# EAGLE design regelschaltplan_e7 (EAGLE 6.5.0)

## Sheet 1 of 5
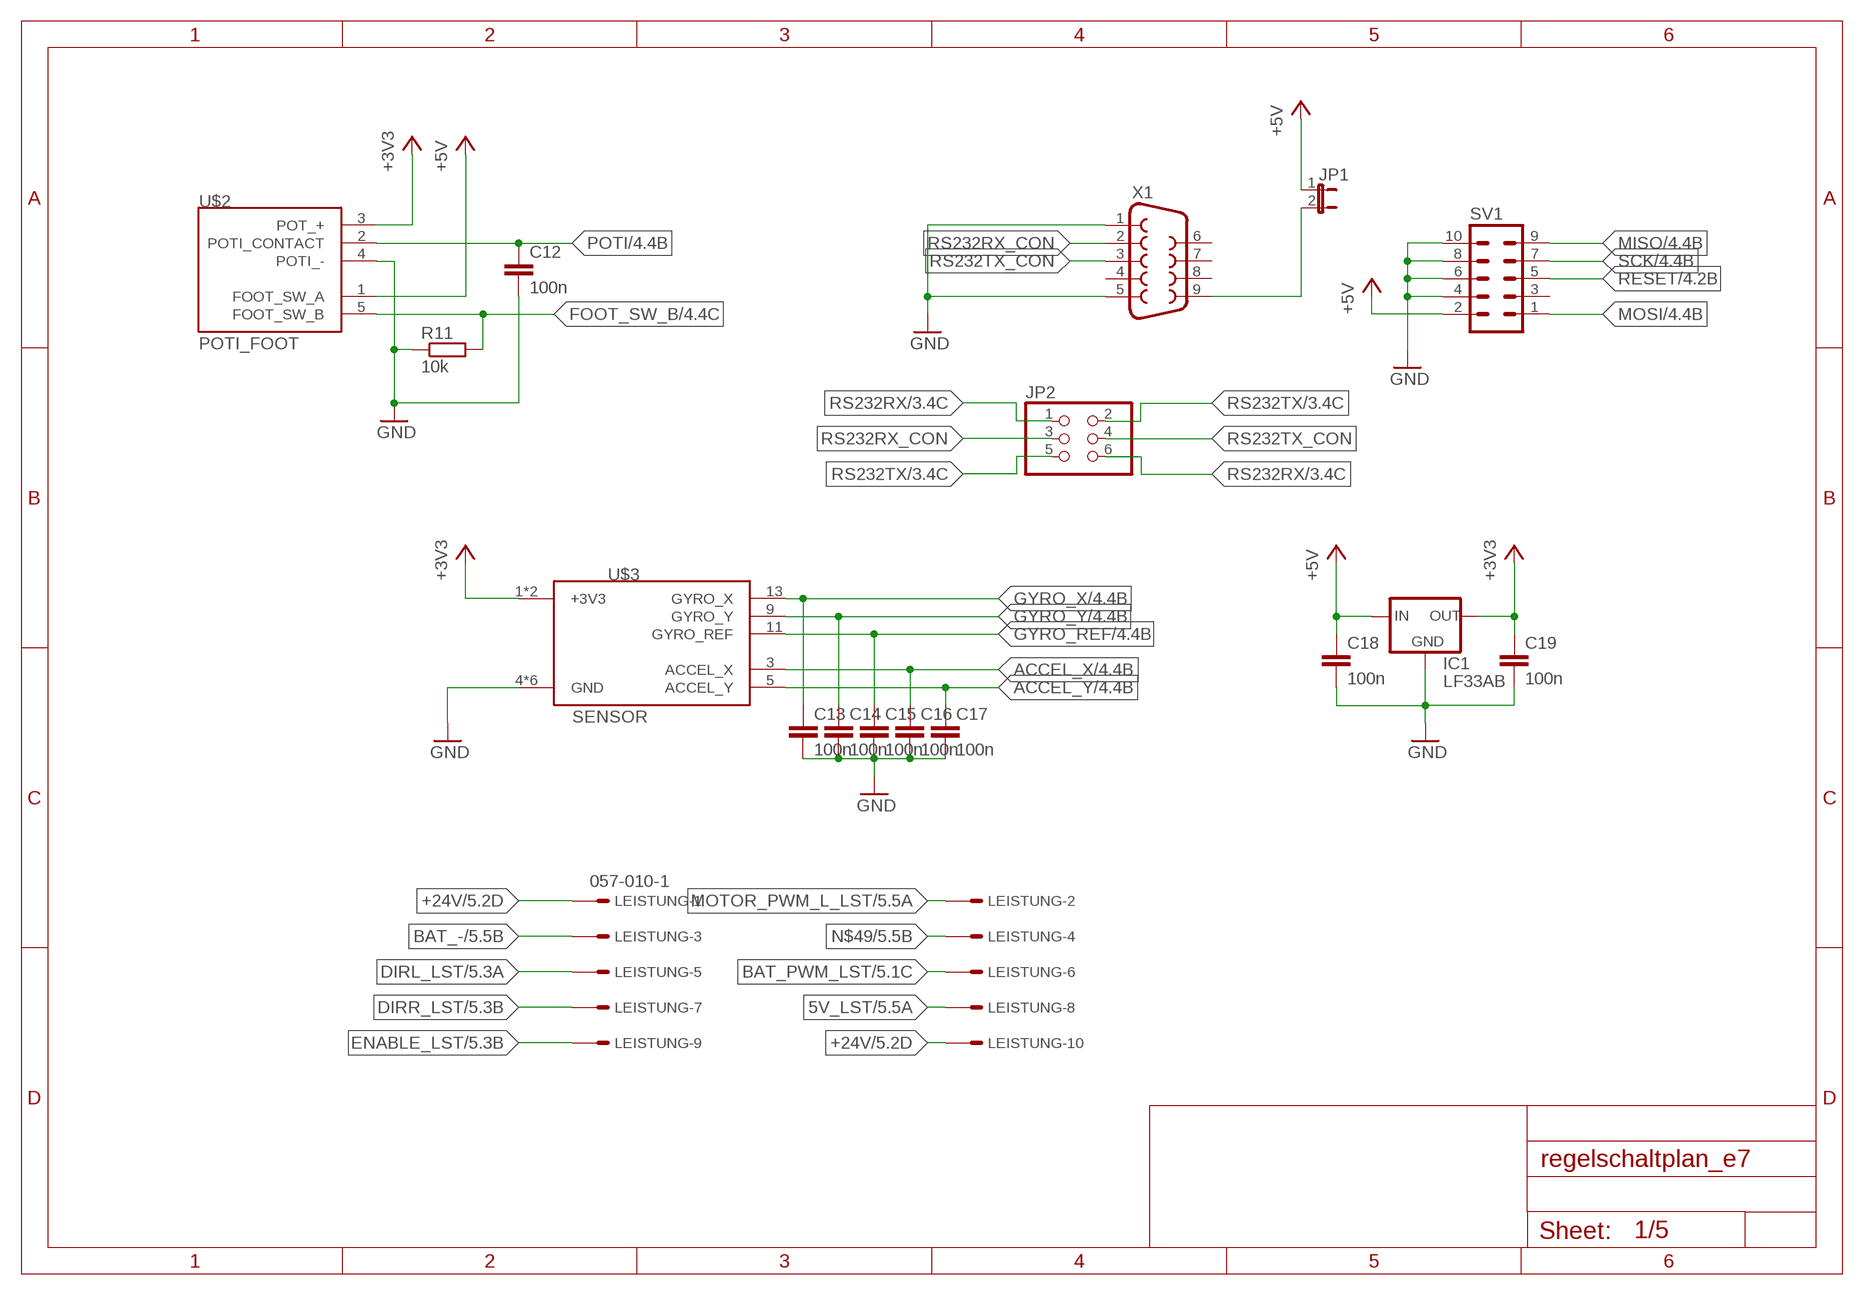
[diagram p0: schematic, sheet 1]

### Parts
C12  100n  C-EU025-025X050  [C025-025X050]
C13  100n  C-EU025-025X050  [C025-025X050]
C14  100n  C-EU025-025X050  [C025-025X050]
C15  100n  C-EU025-025X050  [C025-025X050]
C16  100n  C-EU025-025X050  [C025-025X050]
C17  100n  C-EU025-025X050  [C025-025X050]
C18  100n  C-EU025-025X050  [C025-025X050]
C19  100n  C-EU025-025X050  [C025-025X050]
IC1  LF33AB  [TO220]
JP1  JP1E  [JP1]
JP2  PINHD-2X3  [2X03]
LEISTUNG  057-010-1  [057-010-1]
R11  10k  R-EU_0207/7  [0207/7]
SV1  MA05-2  [MA05-2]
U$2  POTI_FOOT  [CON_6]
U$3  SENSOR  [CON_14]
X1  F09HP  [F09HP]

### Nets
5V_LST: LEISTUNG.8 ; also sheet 5
+3V3: C19.1 IC1.3(OUT) U$2.3(POT_+) U$3.1(+3V3) U$3.2(+3V3) ; also sheet 2,4
+24V: LEISTUNG.1 LEISTUNG.10 ; also sheet 5
ACCEL_X: C16.1 U$3.3(ACCEL_X) ; also sheet 4
ACCEL_Y: C17.1 U$3.5(ACCEL_Y) ; also sheet 4
BAT_-: LEISTUNG.3 ; also sheet 5
BAT_PWM_LST: LEISTUNG.6 ; also sheet 5
DIRL_LST: LEISTUNG.5 ; also sheet 5
DIRR_LST: LEISTUNG.7 ; also sheet 5
ENABLE_LST: LEISTUNG.9 ; also sheet 5
FOOT_SW_B: R11.2 U$2.5(FOOT_SW_B) ; also sheet 4
GND: C12.2 C13.2 C14.2 C15.2 C16.2 C17.2 C18.2 C19.2 IC1.2(GND) R11.1 SV1.4 SV1.6 SV1.8 SV1.10 U$2.4(POTI_-) U$3.4(GND) U$3.6(GND) U$3.8(GND) U$3.10(GND) U$3.12(GND) U$3.14(GND) X1.1 X1.5 ; also sheet 2,3,4,5
GYRO_REF: C15.1 U$3.11(GYRO_REF) ; also sheet 4
GYRO_X: C13.1 U$3.13(GYRO_X) ; also sheet 4
GYRO_Y: C14.1 U$3.9(GYRO_Y) ; also sheet 4
MISO: SV1.9 ; also sheet 4
MOSI: SV1.1 ; also sheet 4
MOTOR_PWM_L_LST: LEISTUNG.2 ; also sheet 5
N$35: C18.1 IC1.1(IN) JP1.1 SV1.2 U$2.1(FOOT_SW_A) ; supply symbol labelled +5V ; also sheet 2,3,4,5
N$45: JP1.2 X1.9
N$49: LEISTUNG.4 ; also sheet 5
POTI: C12.1 U$2.2(POTI_CONTACT) ; also sheet 4
RESET: SV1.5 ; also sheet 4
RS232RX: JP2.1 JP2.6 ; also sheet 3
RS232RX_CON: JP2.3 X1.2
RS232TX: JP2.2 JP2.5 ; also sheet 3
RS232TX_CON: JP2.4 X1.3
SCK: SV1.7 ; also sheet 4
Unconnected: SV1.3 X1.4 X1.6 X1.7 X1.8

## Sheet 2 of 5
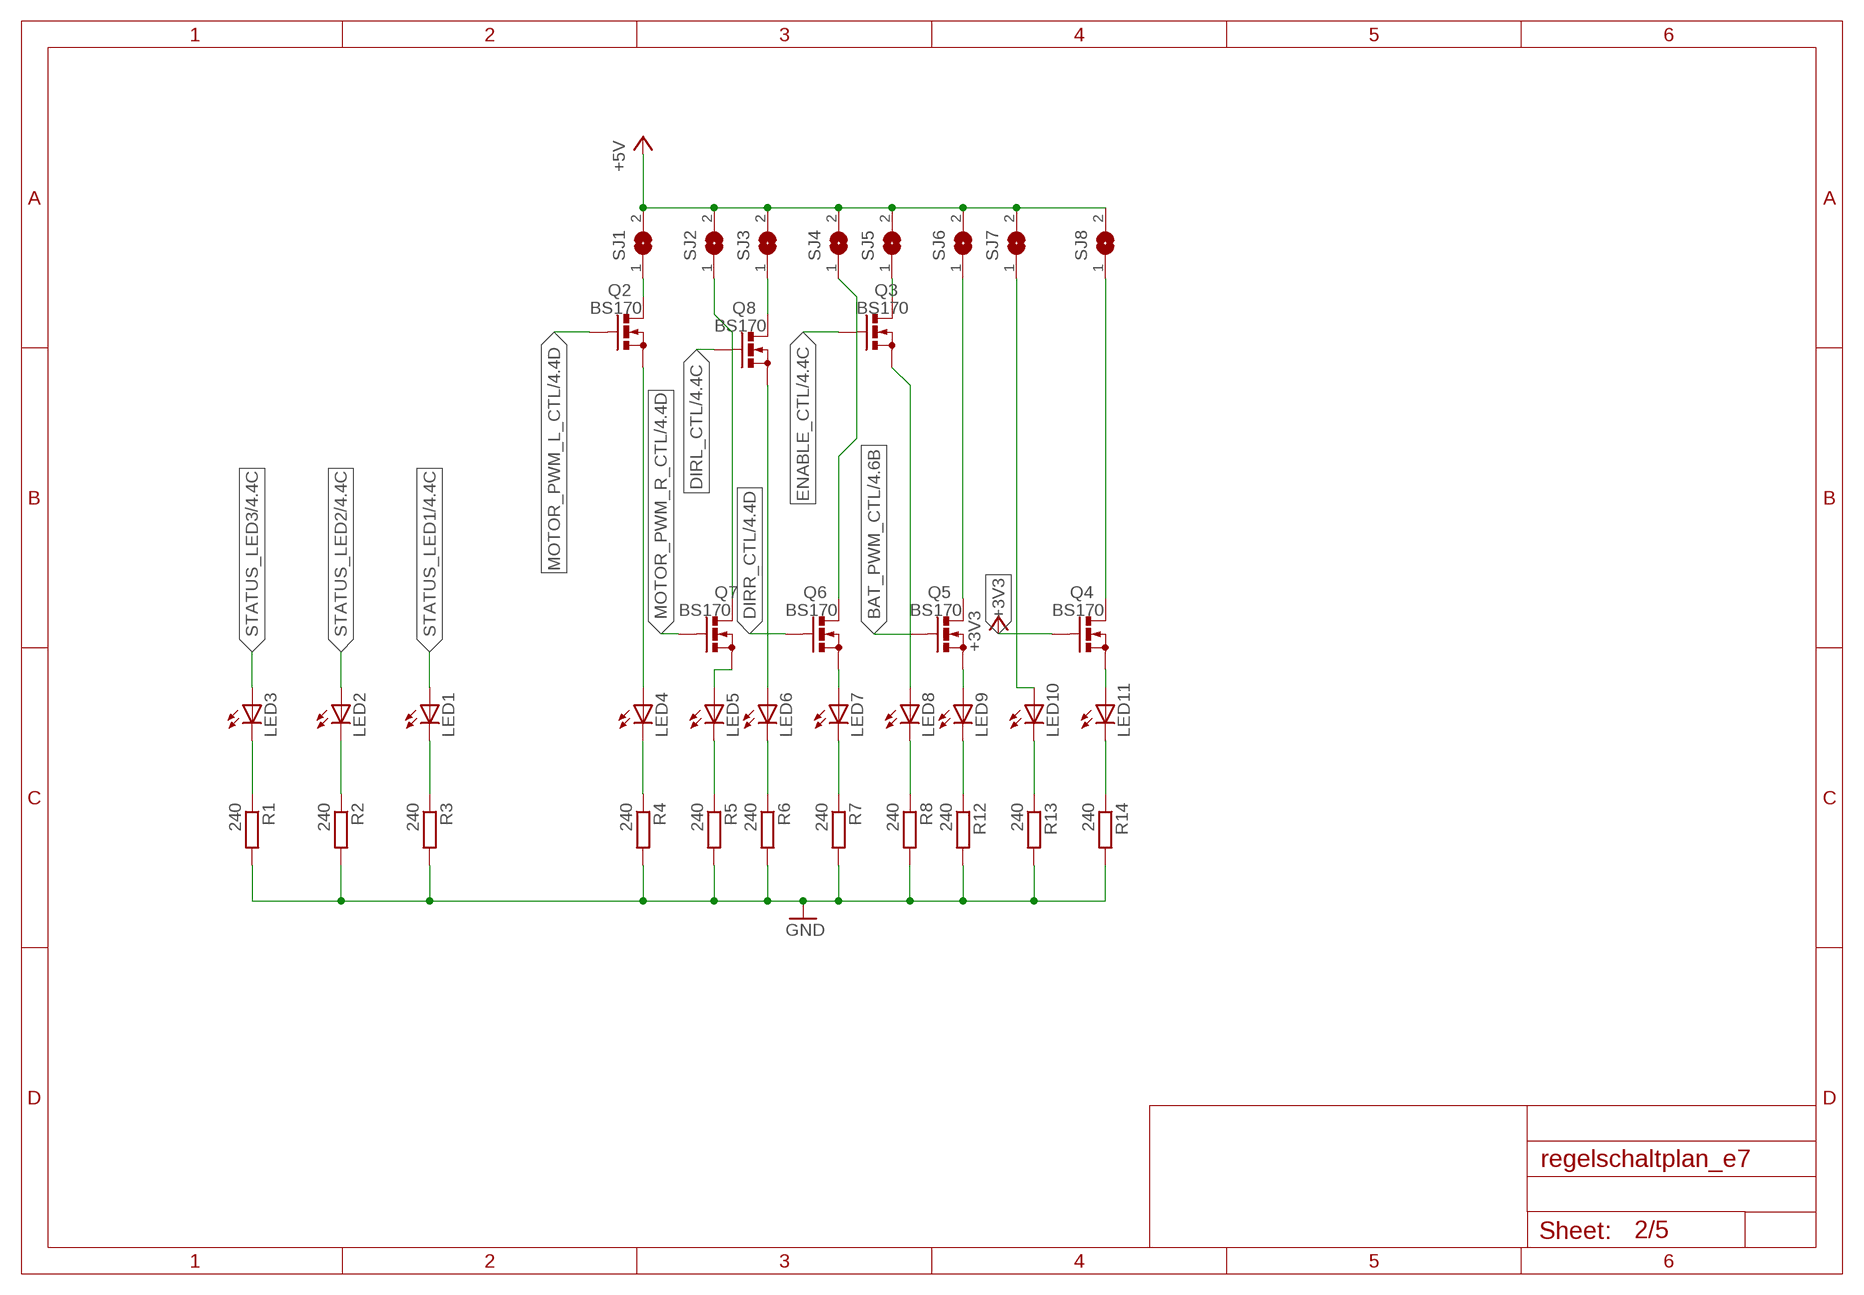
[diagram p1: schematic, sheet 2]

### Parts
LED1  LED3MM  [LED3MM]
LED2  LED3MM  [LED3MM]
LED3  LED3MM  [LED3MM]
LED4  LED3MM  [LED3MM]
LED5  LED3MM  [LED3MM]
LED6  LED3MM  [LED3MM]
LED7  LED3MM  [LED3MM]
LED8  LED3MM  [LED3MM]
LED9  LED3MM  [LED3MM]
LED10  LED3MM  [LED3MM]
LED11  LED3MM  [LED3MM]
Q2  BS170  [SOT54E]
Q3  BS170  [SOT54E]
Q4  BS170  [SOT54E]
Q5  BS170  [SOT54E]
Q6  BS170  [SOT54E]
Q7  BS170  [SOT54E]
Q8  BS170  [SOT54E]
R1  240  R-EU_0207/7  [0207/7]
R2  240  R-EU_0207/7  [0207/7]
R3  240  R-EU_0207/7  [0207/7]
R4  240  R-EU_0207/7  [0207/7]
R5  240  R-EU_0207/7  [0207/7]
R6  240  R-EU_0207/7  [0207/7]
R7  240  R-EU_0207/7  [0207/7]
R8  240  R-EU_0207/7  [0207/7]
R12  240  R-EU_0207/7  [0207/7]
R13  240  R-EU_0207/7  [0207/7]
R14  240  R-EU_0207/7  [0207/7]
SJ1  SJ  [SJ]
SJ2  SJ  [SJ]
SJ3  SJ  [SJ]
SJ4  SJ  [SJ]
SJ5  SJ  [SJ]
SJ6  SJ  [SJ]
SJ7  SJ  [SJ]
SJ8  SJ  [SJ]

### Nets
+3V3: Q4.G ; also sheet 1,4
BAT_PWM_CTL: Q5.G ; also sheet 4,5
DIRL_CTL: Q8.G ; also sheet 4,5
DIRR_CTL: Q6.G ; also sheet 4,5
ENABLE_CTL: Q3.G ; also sheet 4,5
GND: R1.2 R2.2 R3.2 R4.2 R5.2 R6.2 R7.2 R8.2 R12.2 R13.2 R14.2 ; also sheet 1,3,4,5
MOTOR_PWM_L_CTL: Q2.G ; also sheet 4,5
MOTOR_PWM_R_CTL: Q7.G ; also sheet 4,5
N$4: Q2.D SJ1.1
N$7: LED4.K(C) R4.1
N$10: LED5.K(C) R5.1
N$11: LED6.K(C) R6.1
N$13: LED6.A Q8.S
N$14: LED7.K(C) R7.1
N$15: LED8.K(C) R8.1
N$16: LED9.K(C) R12.1
N$17: LED10.K(C) R13.1
N$18: LED11.K(C) R14.1
N$19: LED8.A Q3.S
N$20: LED10.A SJ7.1
N$21: LED9.A Q5.S
N$22: Q4.D SJ8.1
N$23: LED7.A Q6.S
N$24: LED5.A Q7.S
N$25: Q7.D SJ2.1
N$26: LED4.A Q2.S
N$27: LED11.A Q4.S
N$28: LED2.K(C) R2.1
N$29: LED3.K(C) R1.1
N$30: Q6.D SJ4.1
N$31: Q5.D SJ6.1
N$32: Q3.D SJ5.1
N$34: Q8.D SJ3.1
N$35: SJ1.2 SJ2.2 SJ3.2 SJ4.2 SJ5.2 SJ6.2 SJ7.2 SJ8.2 ; supply symbol labelled +5V ; also sheet 1,3,4,5
N$46: LED1.K(C) R3.1
STATUS_LED1: LED1.A ; also sheet 4
STATUS_LED2: LED2.A ; also sheet 4
STATUS_LED3: LED3.A ; also sheet 4

## Sheet 3 of 5
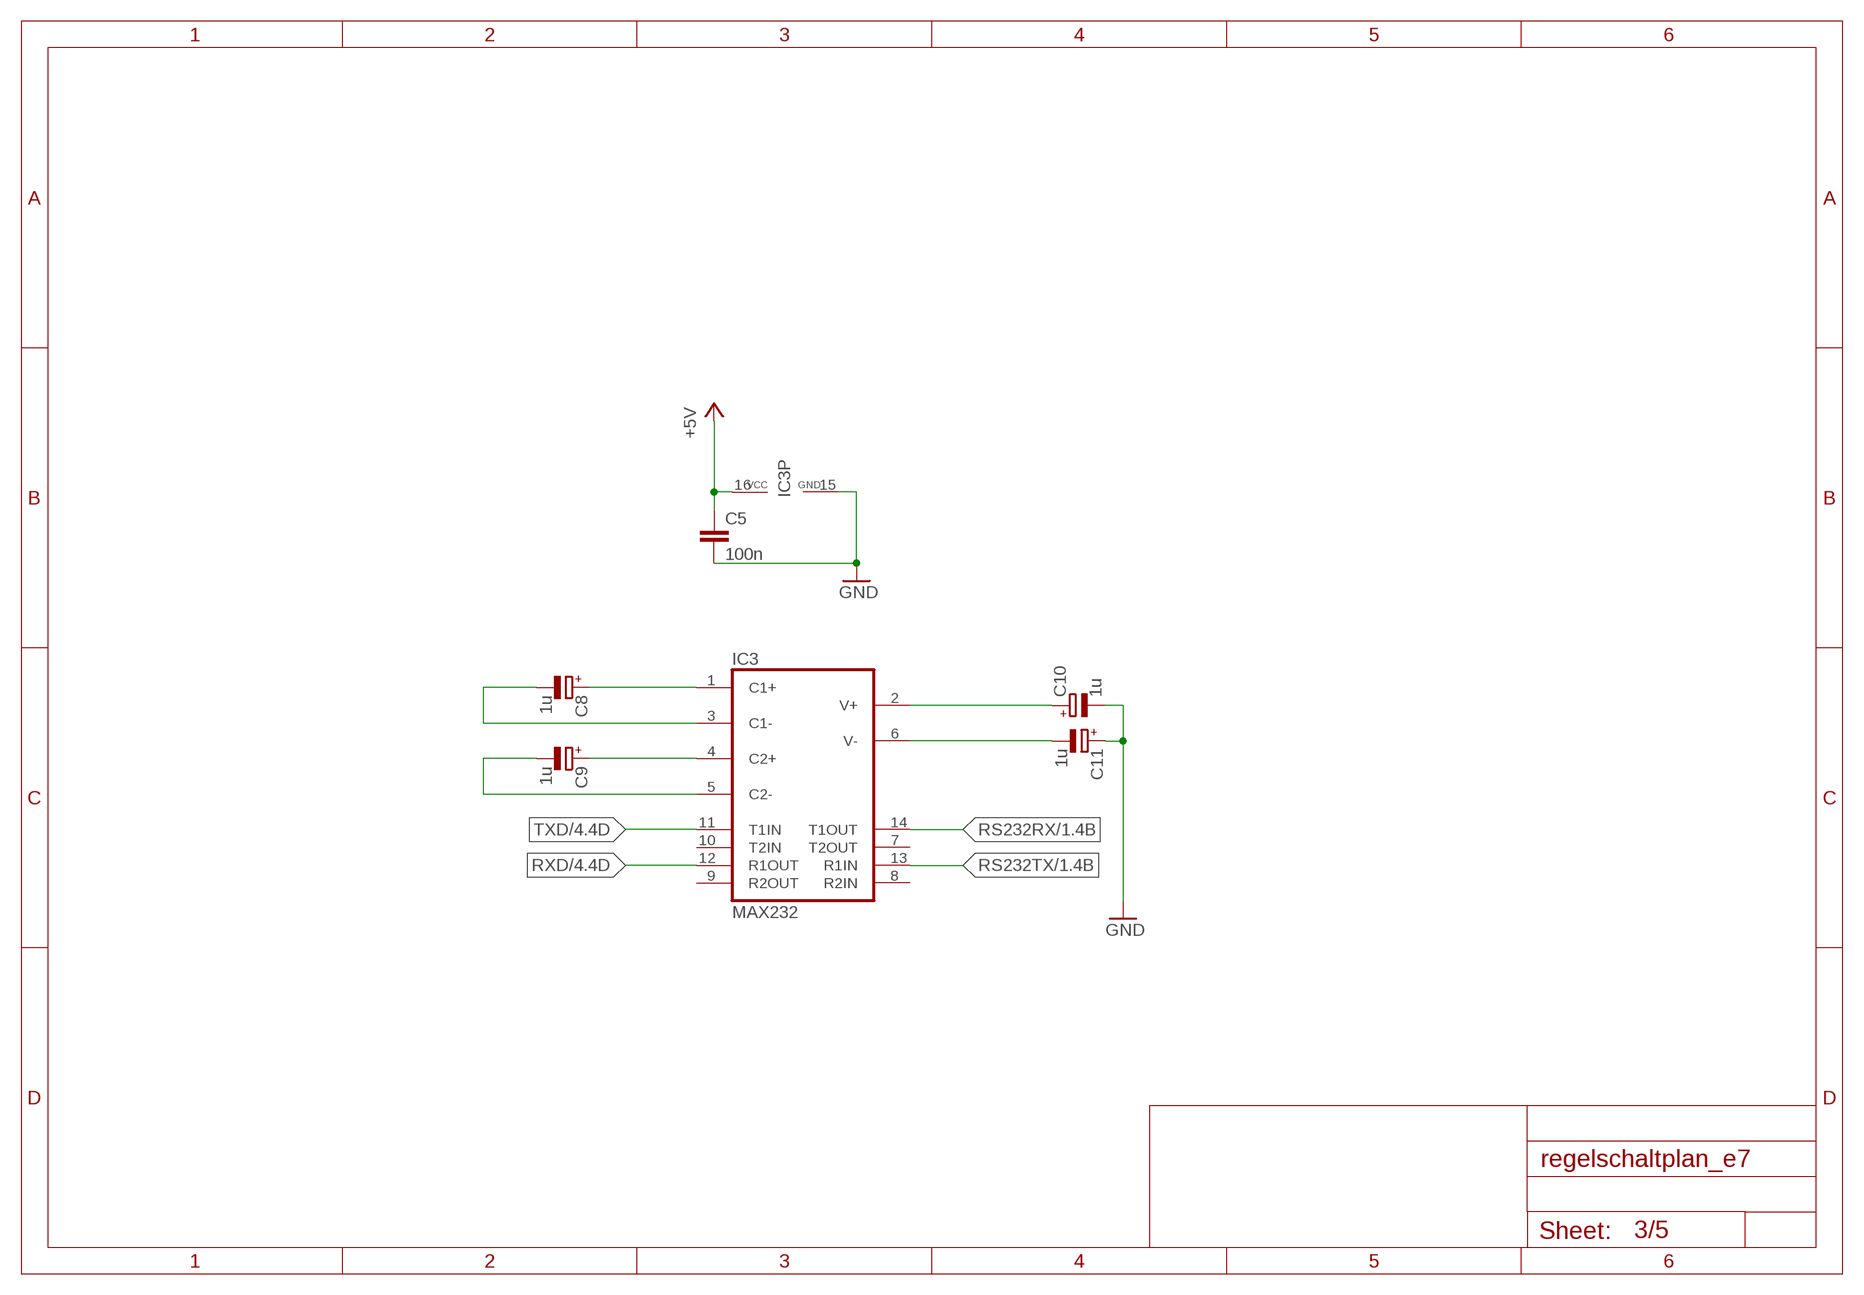
[diagram p2: schematic, sheet 3]

### Parts
C5  100n  C-EU025-025X050  [C025-025X050]
C8  1u  CPOL-EUE2,5-6E  [E2,5-6E]
C9  1u  CPOL-EUE2,5-6E  [E2,5-6E]
C10  1u  CPOL-EUE2,5-6E  [E2,5-6E]
C11  1u  CPOL-EUE2,5-6E  [E2,5-6E]
IC3  MAX232  [DIL16]

### Nets
GND: C5.2 C10.- C11.+ IC3.15(GND) ; also sheet 1,2,4,5
N$1: C8.+ IC3.1(C1+)
N$5: C8.- IC3.3(C1-)
N$6: C9.+ IC3.4(C2+)
N$8: C10.+ IC3.2(V+)
N$9: C11.- IC3.6(V-)
N$35: C5.1 IC3.16(VCC) ; supply symbol labelled +5V ; also sheet 1,2,4,5
NS1234: C9.- IC3.5(C2-)
RS232RX: IC3.14(T1OUT) ; also sheet 1
RS232TX: IC3.13(R1IN) ; also sheet 1
RXD: IC3.12(R1OUT) ; also sheet 4
TXD: IC3.11(T1IN) ; also sheet 4
Unconnected: IC3.7(T2OUT) IC3.8(R2IN) IC3.9(R2OUT) IC3.10(T2IN)

## Sheet 4 of 5
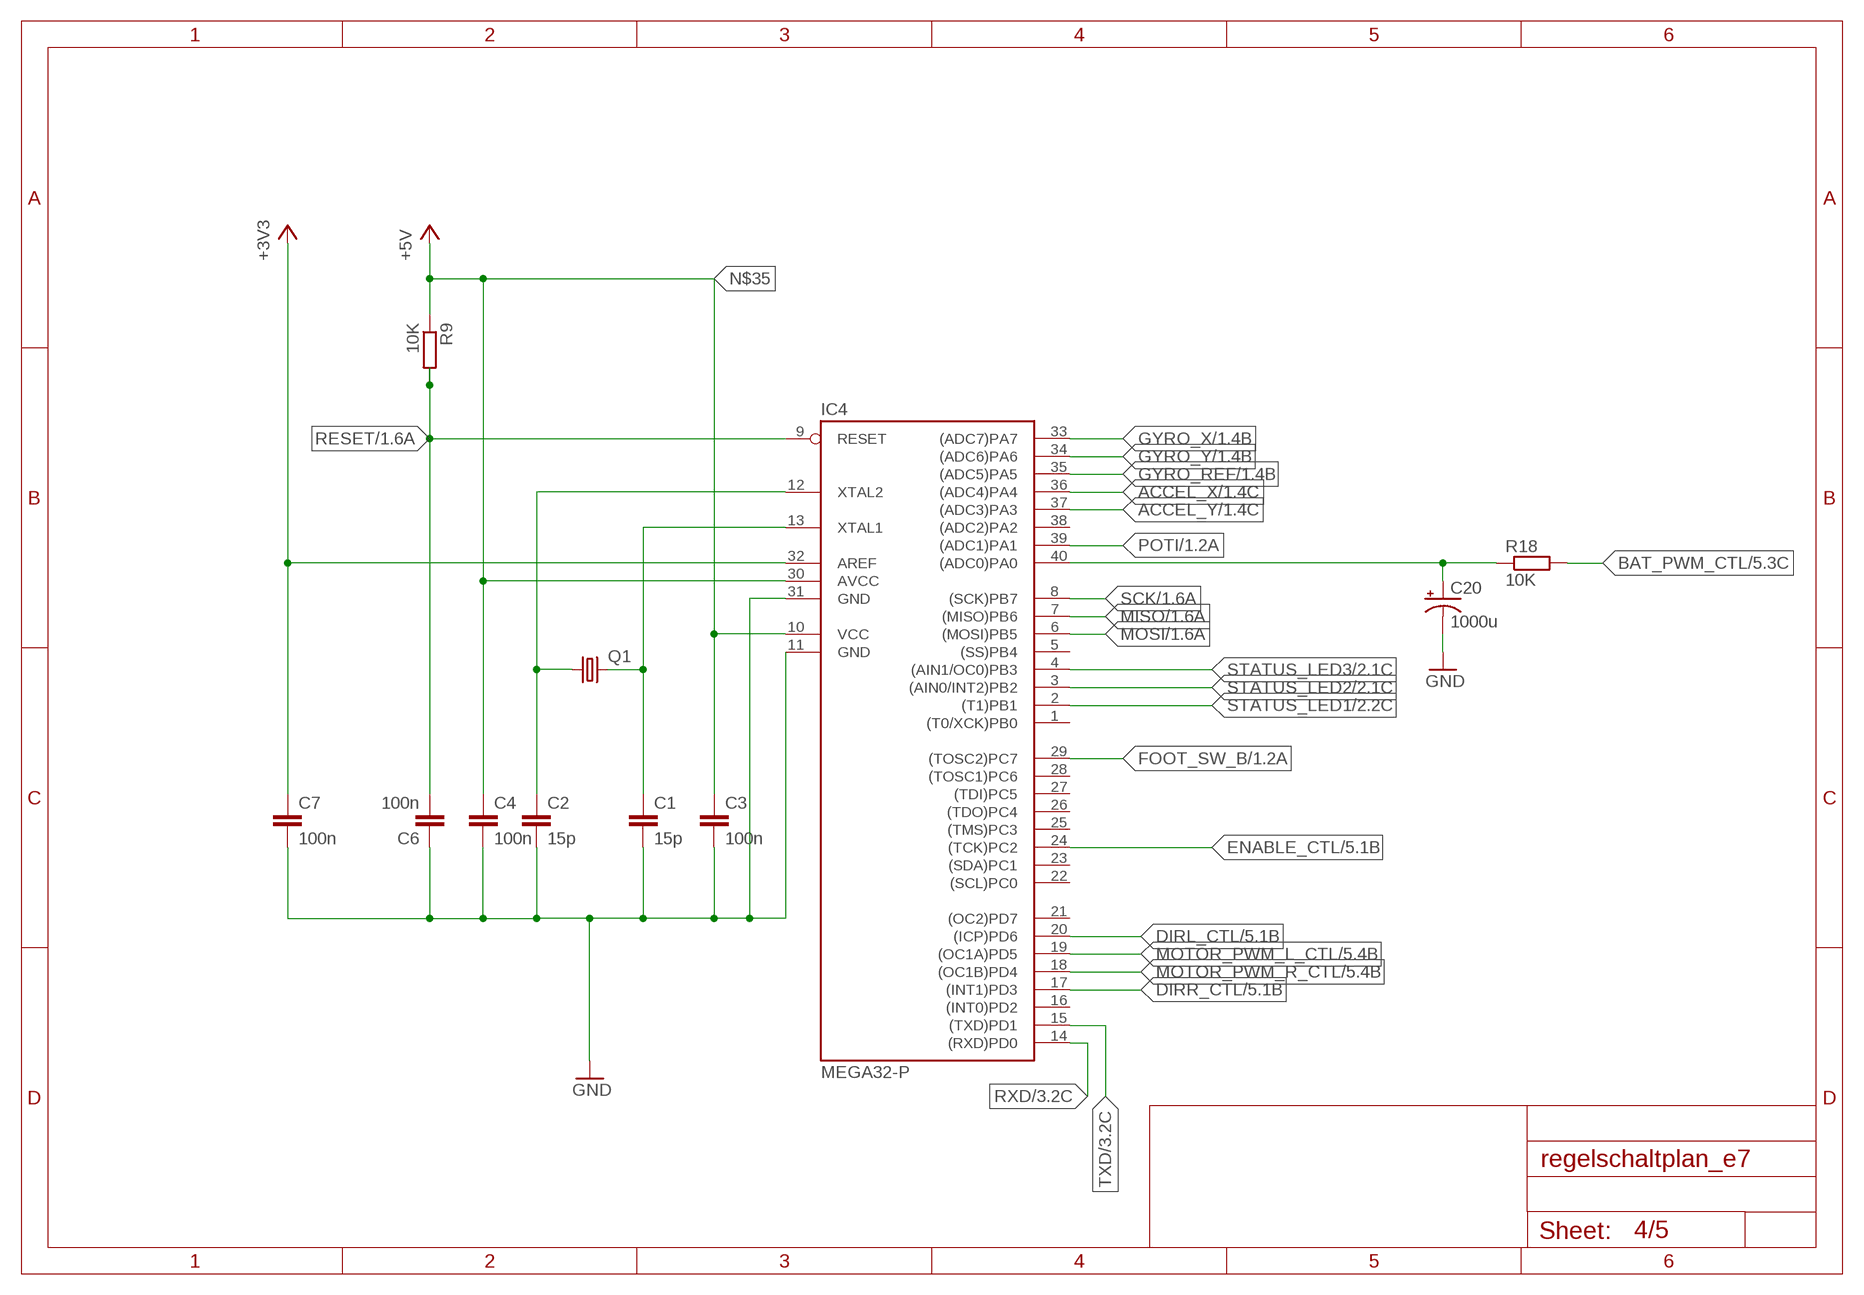
[diagram p3: schematic, sheet 4]

### Parts
C1  15p  C-EU025-025X050  [C025-025X050]
C2  15p  C-EU025-025X050  [C025-025X050]
C3  100n  C-EU025-025X050  [C025-025X050]
C4  100n  C-EU025-025X050  [C025-025X050]
C6  100n  C-EU025-025X050  [C025-025X050]
C7  100n  C-EU025-025X050  [C025-025X050]
C20  1000u  CPOL-USE2,5-6E  [E2,5-6E]
IC4  MEGA32-P  [DIL40]
Q1  CRYSTALHC49U-V  [HC49U-V]
R9  10K  R-EU_0207/7  [0207/7]
R18  10K  R-EU_0207/7  [0207/7]

### Nets
+3V3: C7.1 IC4.32(AREF) ; also sheet 1,2
ACCEL_X: IC4.36((ADC4)PA4) ; also sheet 1
ACCEL_Y: IC4.37((ADC3)PA3) ; also sheet 1
BAT_PWM_CTL: R18.2 ; also sheet 2,5
DIRL_CTL: IC4.20((ICP)PD6) ; also sheet 2,5
DIRR_CTL: IC4.17((INT1)PD3) ; also sheet 2,5
ENABLE_CTL: IC4.24((TCK)PC2) ; also sheet 2,5
FOOT_SW_B: IC4.29((TOSC2)PC7) ; also sheet 1
GND: C1.2 C2.2 C3.2 C4.2 C6.1 C7.2 C20.- IC4.11(GND) IC4.31(GND) ; also sheet 1,2,3,5
GYRO_REF: IC4.35((ADC5)PA5) ; also sheet 1
GYRO_X: IC4.33((ADC7)PA7) ; also sheet 1
GYRO_Y: IC4.34((ADC6)PA6) ; also sheet 1
MISO: IC4.7((MISO)PB6) ; also sheet 1
MOSI: IC4.6((MOSI)PB5) ; also sheet 1
MOTOR_PWM_L_CTL: IC4.19((OC1A)PD5) ; also sheet 2,5
MOTOR_PWM_R_CTL: IC4.18((OC1B)PD4) ; also sheet 2,5
N$2: C2.1 IC4.12(XTAL2) Q1.1
N$3: C1.1 IC4.13(XTAL1) Q1.2
N$12: C20.+ IC4.40((ADC0)PA0) R18.1
N$35: C3.1 C4.1 IC4.10(VCC) IC4.30(AVCC) R9.1 ; supply symbol labelled +5V ; also sheet 1,2,3,5
POTI: IC4.39((ADC1)PA1) ; also sheet 1
RESET: C6.2 IC4.9(RESET) R9.2 ; also sheet 1
RXD: IC4.14((RXD)PD0) ; also sheet 3
SCK: IC4.8((SCK)PB7) ; also sheet 1
STATUS_LED1: IC4.2((T1)PB1) ; also sheet 2
STATUS_LED2: IC4.3((AIN0/INT2)PB2) ; also sheet 2
STATUS_LED3: IC4.4((AIN1/OC0)PB3) ; also sheet 2
TXD: IC4.15((TXD)PD1) ; also sheet 3
Unconnected: IC4.1((T0/XCK)PB0) IC4.5((SS)PB4) IC4.16((INT0)PD2) IC4.21((OC2)PD7) IC4.22((SCL)PC0) IC4.23((SDA)PC1) IC4.25((TMS)PC3) IC4.26((TDO)PC4) IC4.27((TDI)PC5) IC4.28((TOSC1)PC6) IC4.38((ADC2)PA2)

## Sheet 5 of 5: galvanic decoupling
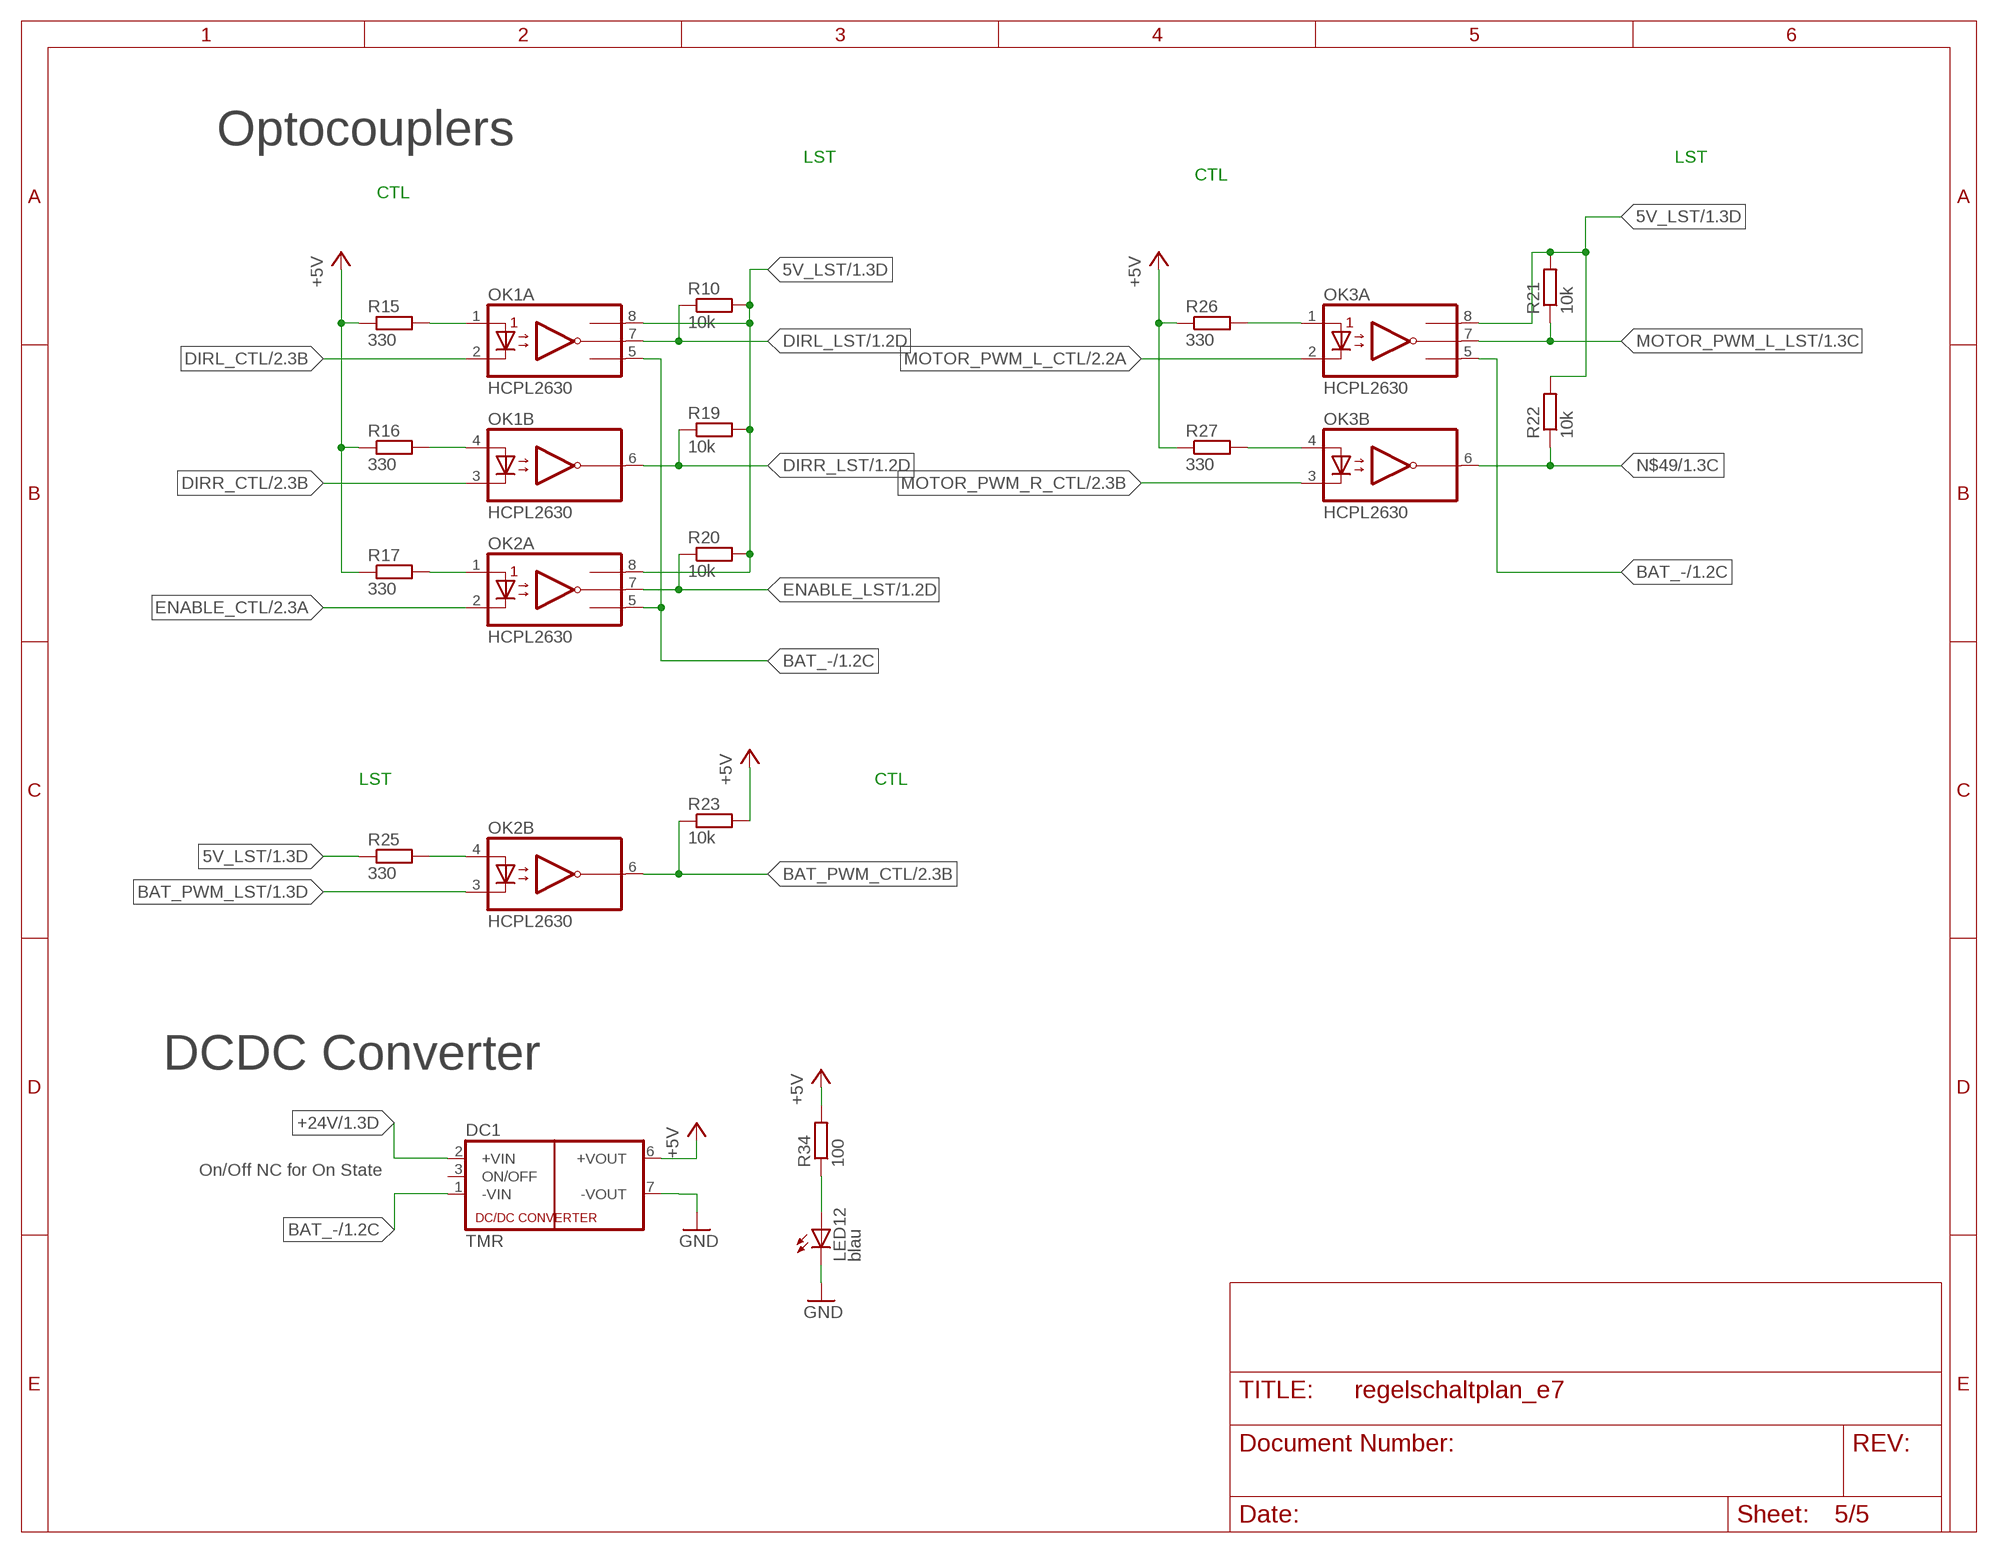
[diagram p4: schematic, sheet 5]

### Parts
DC1  TMR  [TRACO_SIP-8]
LED12  blau  LED3MM  [LED3MM]
OK1  HCPL2630  [DIL08]
OK2  HCPL2630  [DIL08]
OK3  HCPL2630  [DIL08]
R10  10k  R-EU_0207/10  [0207/10]
R15  330  R-EU_0207/10  [0207/10]
R16  330  R-EU_0207/10  [0207/10]
R17  330  R-EU_0207/10  [0207/10]
R19  10k  R-EU_0207/10  [0207/10]
R20  10k  R-EU_0207/10  [0207/10]
R21  10k  R-EU_0207/10  [0207/10]
R22  10k  R-EU_0207/10  [0207/10]
R23  10k  R-EU_0207/10  [0207/10]
R25  330  R-EU_0207/10  [0207/10]
R26  330  R-EU_0207/10  [0207/10]
R27  330  R-EU_0207/10  [0207/10]
R34  100  R-EU_0207/10  [0207/10]

### Nets
5V_LST: OK1.8(A:VCC) OK2.8(A:VCC) OK3.8(A:VCC) R10.2 R19.2 R20.2 R21.2 R22.2 R25.1 ; also sheet 1
+24V: DC1.2(+VIN) ; also sheet 1
BAT_-: DC1.1(-VIN) OK1.5(A:GND) OK2.5(A:GND) OK3.5(A:GND) ; also sheet 1
BAT_PWM_CTL: OK2.6(B:VO2) R23.1 ; also sheet 2,4
BAT_PWM_LST: OK2.3(B:C2) ; also sheet 1
DIRL_CTL: OK1.2(A:C1) ; also sheet 2,4
DIRL_LST: OK1.7(A:VO1) R10.1 ; also sheet 1
DIRR_CTL: OK1.3(B:C2) ; also sheet 2,4
DIRR_LST: OK1.6(B:VO2) R19.1 ; also sheet 1
ENABLE_CTL: OK2.2(A:C1) ; also sheet 2,4
ENABLE_LST: OK2.7(A:VO1) R20.1 ; also sheet 1
GND: DC1.7(-VOUT) LED12.K(C) ; also sheet 1,2,3,4
MOTOR_PWM_L_CTL: OK3.2(A:C1) ; also sheet 2,4
MOTOR_PWM_L_LST: OK3.7(A:VO1) R21.1 ; also sheet 1
MOTOR_PWM_R_CTL: OK3.3(B:C2) ; also sheet 2,4
N$35: DC1.6(+VOUT) R15.1 R16.1 R17.1 R23.2 R26.1 R27.1 R34.2 ; supply symbol labelled +5V ; also sheet 1,2,3,4
N$36: OK1.1(A:A1) R15.2
N$37: OK1.4(B:A2) R16.2
N$38: OK2.1(A:A1) R17.2
N$39: OK2.4(B:A2) R25.2
N$40: OK3.4(B:A2) R27.2
N$41: OK3.1(A:A1) R26.2
N$42: LED12.A R34.1
N$49: OK3.6(B:VO2) R22.1 ; also sheet 1
Unconnected: DC1.3(ON/OFF)

### Notes on the sheet
- Optocouplers
- LST | LST
- CTL
- CTL
- LST | CTL
- DCDC Converter
- On/Off NC for On State

## Library data of the parts
C1-C7 C12-C19 = rcl:C-EU: CAPACITOR, European symbol
C8-C11 = rcl:CPOL-EU: POLARIZED CAPACITOR, European symbol
C20 = rcl:CPOL-US: POLARIZED CAPACITOR, American symbol
DC1 = regelschaltplan_e7:TMR
IC1 = lsd2016:LF33AB
IC3 = maxim:MAX232: RS232 TRANSCEIVER; MF: MAXIM; MPN: MAX232ACPE+; OC_FARNELL: 9723773; OC_NEWARK: 68K4544
IC4 = atmel:MEGA32-P: MICROCONTROLLER 32 Kbytes FLASH 2 Kbytes SRAM 1 Kbytes EEPROM USART 8-channel 10 bit ADC Source: www.atmel.com .. doc2503.pdf; MPN: ATMEGA32-16PU; OC_FARNELL: 1661729; OC_NEWARK: 51P1794
JP1 = jumper:JP1E: JUMPER
JP2 = pinhead:PINHD-2X3: PIN HEADER
LED1-LED12 = led:LED: LED OSRAM: - CHIPLED LG R971, LG N971, LY N971, LG Q971, LY Q971, LO R971, LY R971 LH N974, LH R974 LS Q976, LO Q976, LY Q976 LO Q996 - Hyper CHIPLED LW Q18S LB Q993, LB Q99A, LB R99A - SideLED LS A670, LO A670, LY A670, LG A670, LP A670 LB A673, LV A673, LT A673, LW A673 LH A674 LY A675 LS A676, LA A676, LO A676, LY A676, LW A676 LS A679, LY A679, LG A679 - Hyper Micro SIDELED® LS Y876, LA Y876, LO Y876, LY Y876 LT Y87S - SmartLED LW L88C, LW L88S LB L89C, LB L89S, LG L890 LS L89K, LO L89K, LY L89K LS L896, LA L896, LO L896, LY L896 - TOPLED LS T670, LO T670, LY T670, LG T670, LP T670 LSG T670, LSP T670, LSY T670, LOP T670, LYG T670 LG T671, LOG T671, LSG T671 LB T673, LV T673, LT T673, LW T673 LH T674 LS T676, LA T676, LO T676, LY T676, LB T676, LH T676, LSB T676, LW T676 LB T67C, LV T67C, LT T67C, LS T67K, LO T67K, LY T67K, LW E67C LS E67B, LA E67B, LO E67B, LY E67B, LB E67C, LV E67C, LT E67C LW T67C LS T679, LY T679, LG T679 LS T770, LO T770, LY T770, LG T770, LP T770 LB T773, LV T773, LT T773, LW T773 LH T774 LS E675, LA E675, LY E675, LS T675 LS T776, LA T776, LO T776, LY T776, LB T776 LHGB T686 LT T68C, LB T68C - Hyper Mini TOPLED® LB M676 - Mini TOPLED Santana® LG M470 LS M47K, LO M47K, LY M47K Source: http://www.osram.convergy.de LUXEON: - LUMILED® LXK2-PW12-R00, LXK2-PW12-S00, LXK2-PW14-U00, LXK2-PW14-V00 LXK2-PM12-R00, LXK2-PM12-S00, LXK2-PM14-U00 LXK2-PE12-Q00, LXK2-PE12-R00, LXK2-PE12-S00, LXK2-PE14-T00, LXK2-PE14-U00 LXK2-PB12-K00, LXK2-PB12-L00, LXK2-PB12-M00, LXK2-PB14-N00, LXK2-PB14-P00, LXK2-PB14-Q00 LXK2-PR12-L00, LXK2-PR12-M00, LXK2-PR14-Q00, LXK2-PR14-R00 LXK2-PD12-Q00, LXK2-PD12-R00, LXK2-PD12-S00 LXK2-PH12-R00, LXK2-PH12-S00 LXK2-PL12-P00, LXK2-PL12-Q00, LXK2-PL12-R00 Source: www.luxeon.com KINGBRIGHT: KA-3528ASYC Source: www.kingbright.com
LEISTUNG = con-panduit:057-010-: CONNECTOR 10-pin series 057 contact pc board low profile headers; OC_FARNELL: unknown; OC_NEWARK: unknown
OK1-OK3 = optocoupler:HCPL2630: HEWLETT PACKARD OPTO COUPLER; MF: AGILENT TECHNOLOGIES; MPN: HCPL-2630-000E; OC_FARNELL: 9994904; OC_NEWARK: 88H7813
Q1 = crystal:CRYSTAL: CRYSTAL; OC_FARNELL: 1666969; OC_NEWARK: unknown
Q2-Q8 = transistor-small-signal:BS170: N-CHANNEL MOS FET
R1-R23 R25-R27 R34 = rcl:R-EU_: RESISTOR, European symbol
SJ1-SJ8 = jumper:SJ: SMD solder JUMPER
SV1 = con-lstb:MA05-2: PIN HEADER; OC_FARNELL: unknown; OC_NEWARK: unknown
U$2 = lsd2016:POTI_FOOT
U$3 = lsd2016:SENSOR
X1 = con-subd:F09: SUB-D; OC_FARNELL: unknown; OC_NEWARK: unknown

## Board
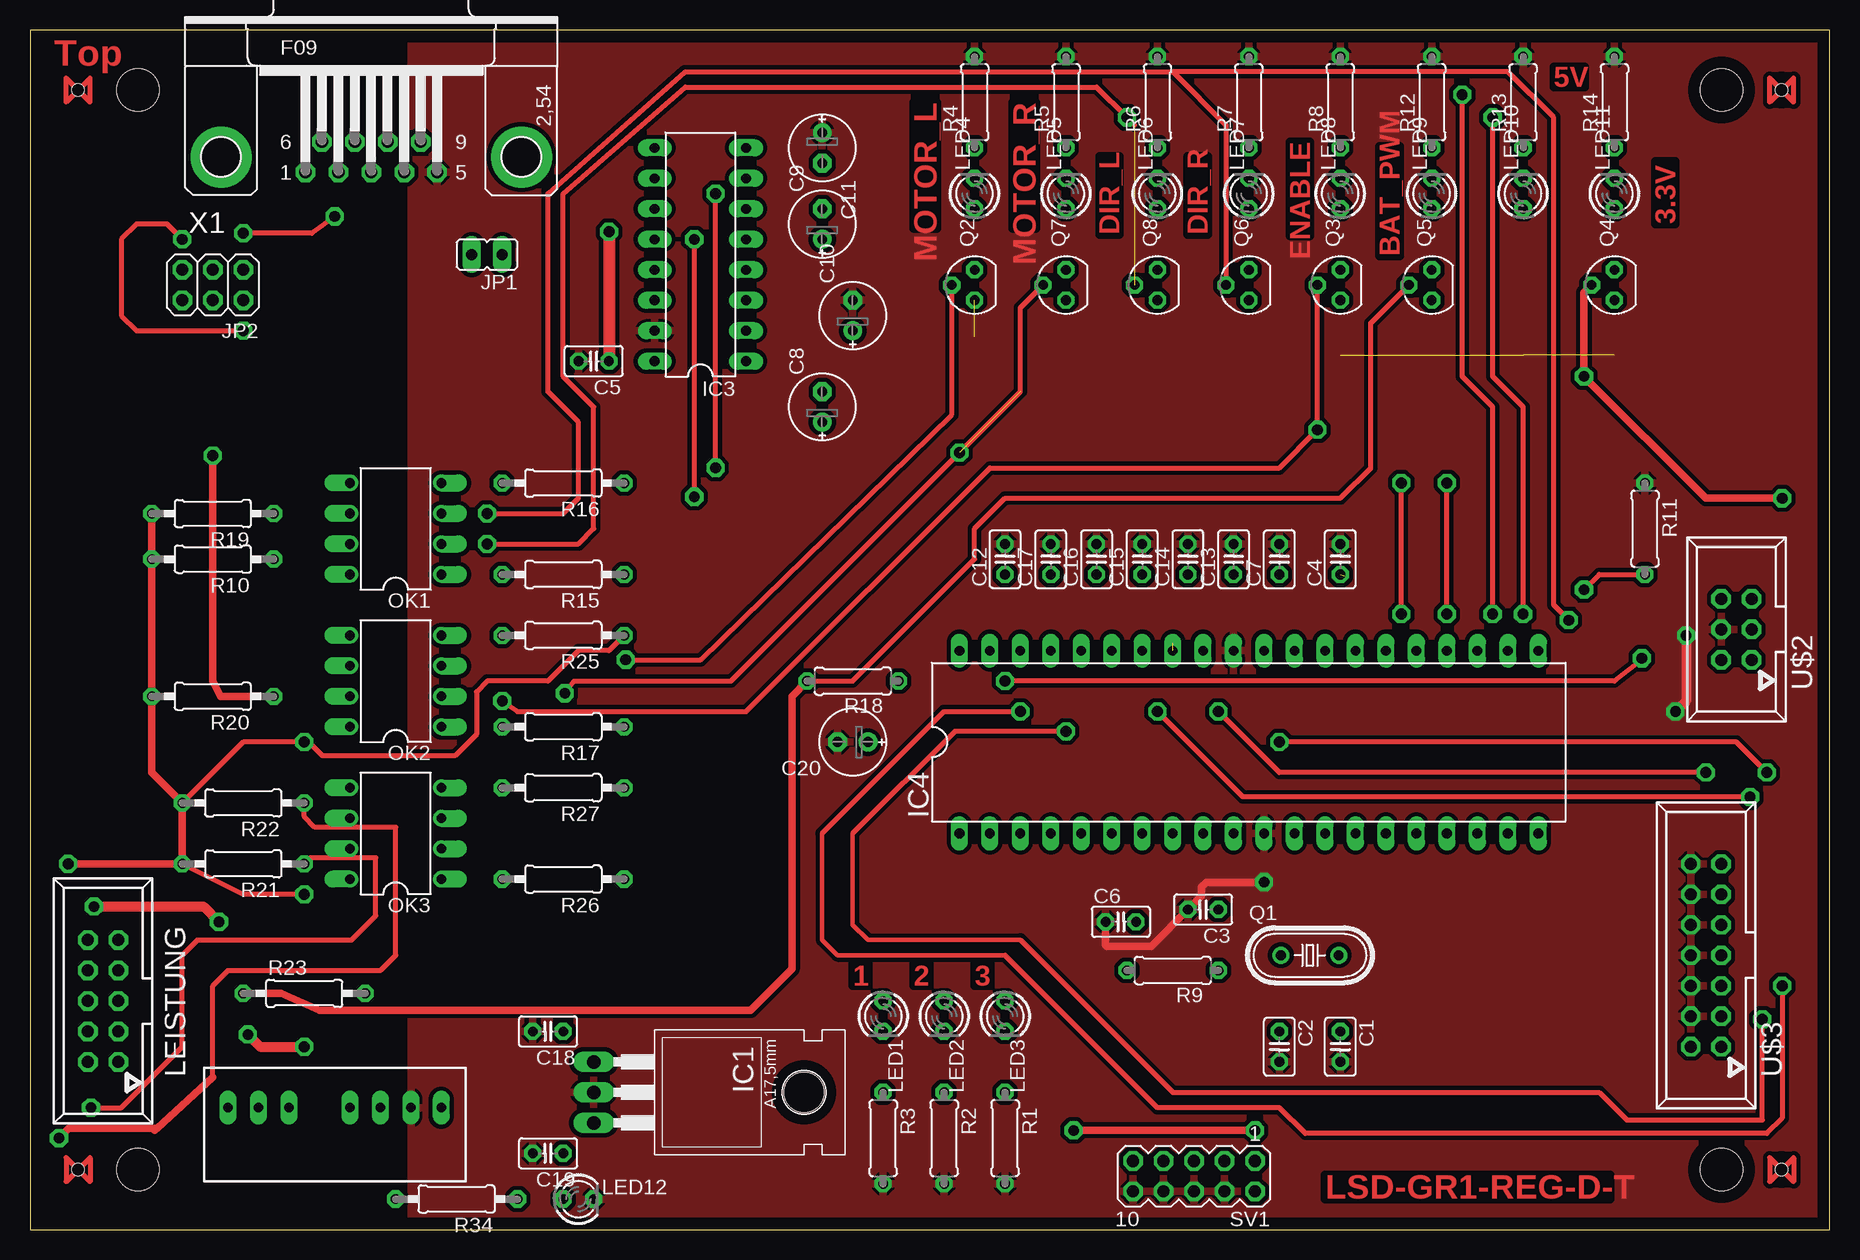
[diagram p5: board, top side]
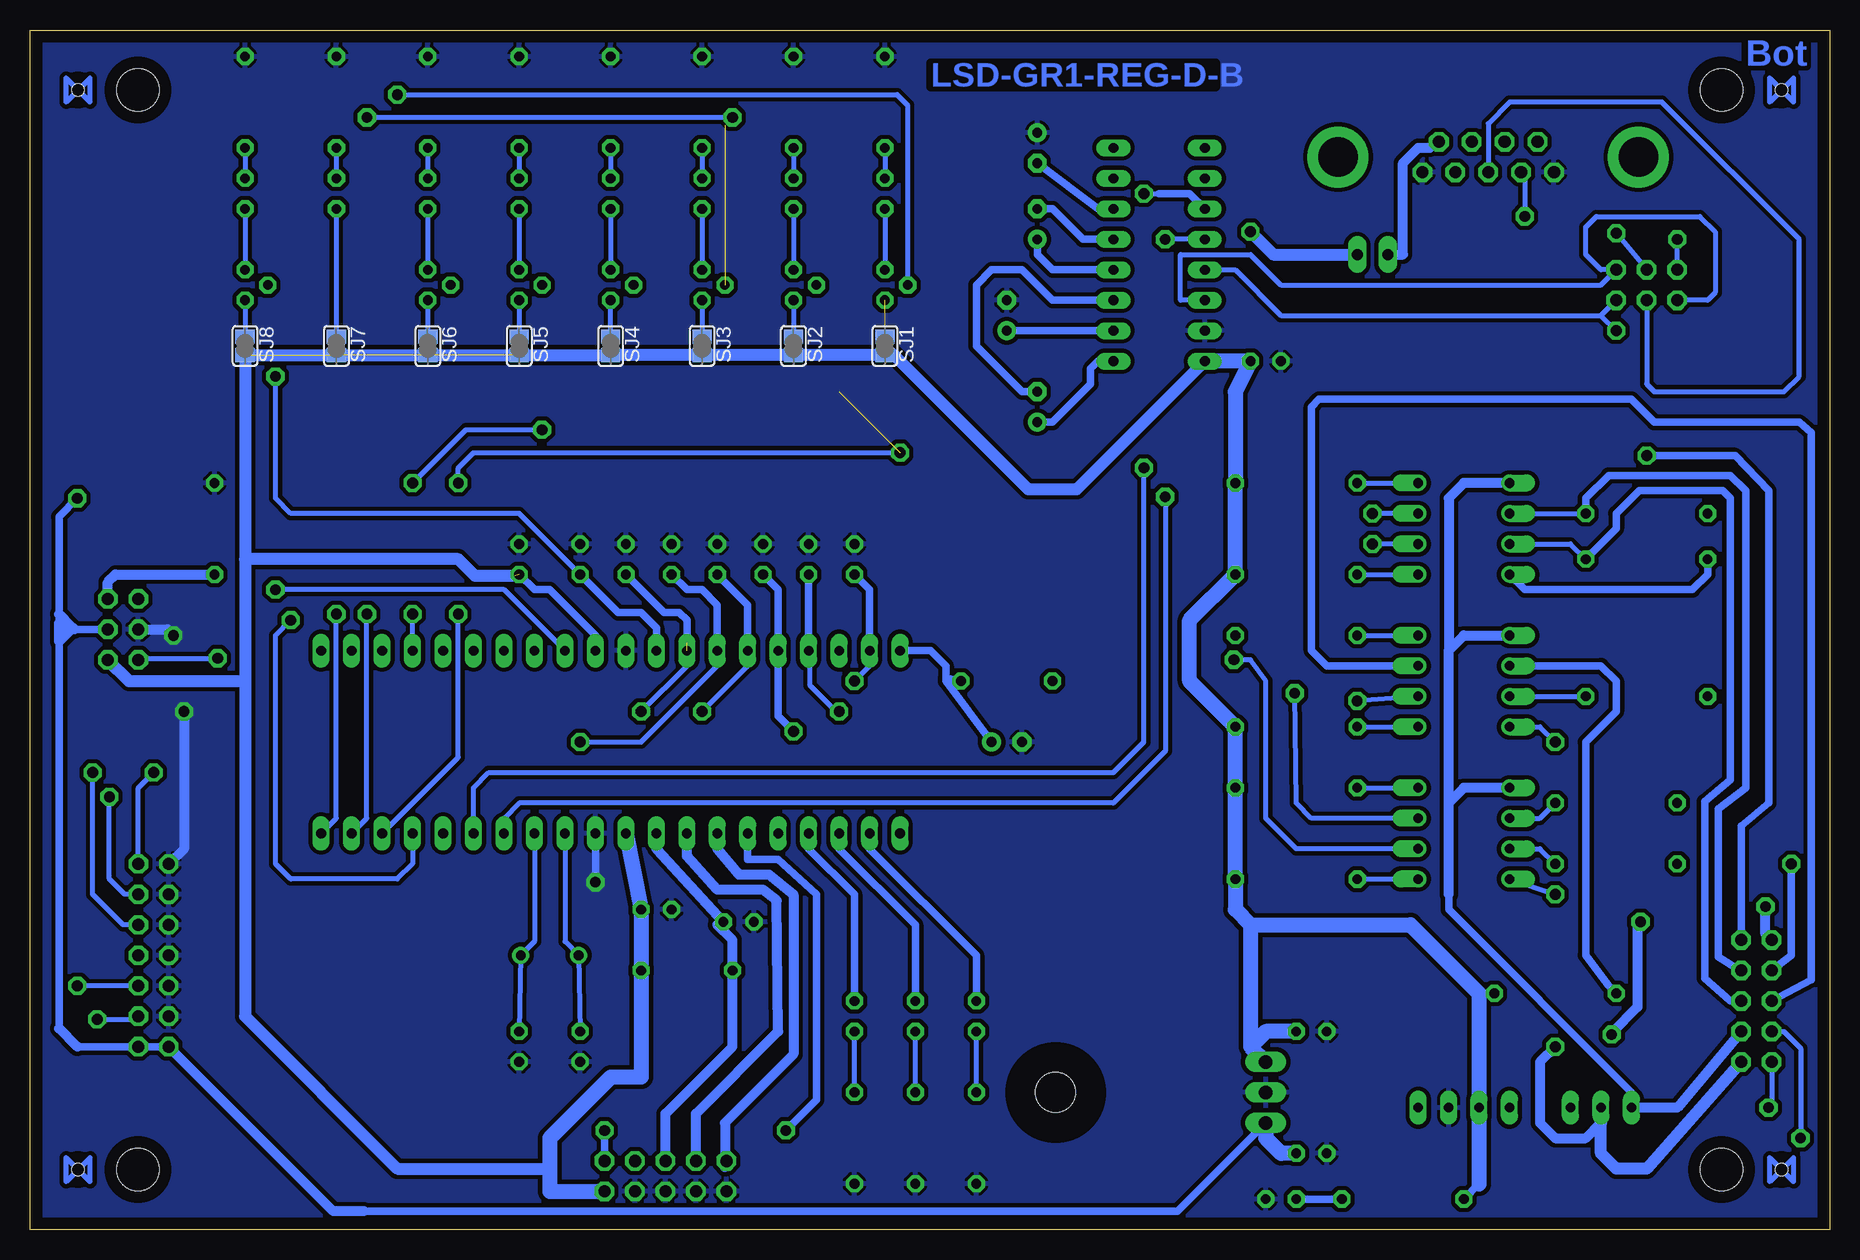
[diagram p6: board, bottom side, seen from below]

Size 150 x 100 mm. Coordinates in mm from the lower left corner, seen from the top.
Copper layers (1*16): Top 0.035mm / dielectric 1.5mm / Bottom 0.035mm
Design rules "default *": minimum track width 14mil, minimum drill 0.8mm, track to track 14mil, track to pad 14mil, pad to pad 14mil, via to via 14mil, smd to smd 14mil, copper to edge 40mil, drill to drill 14mil, minimum pad ring 12mil, minimum via ring 12mil, stop-mask expansion 6mil, vias tented up to drill 0mil, thermal gap 10mil

### Footprints (pad centres in the part's own frame; a part is rotated, then mirrored left to right if it is on the bottom)
C025-025X050 = drill 0.813 octagon: 1 -1.27,0; 2 1.27,0
E2,5-6E = drill 0.813 pad 1.575: + -1.27,0 | drill 0.813 pad 1.575 octagon: - 1.27,0
TRACO_SIP-8 = drill 0.8 long: 1 -8.89,0; 2 -6.35,0; 3 -3.81,0; 5 1.27,0; 6 3.81,0; 7 6.35,0; 8 8.89,0
TO220 = drill 1.118 long: 1 -2.54,-6.35; 2 0,-6.35; 3 2.54,-6.35 | hole 3.302: 0,11.176
DIL16 = drill 0.813 long: 1 -8.89,-3.81; 2 -6.35,-3.81; 3 -3.81,-3.81; 4 -1.27,-3.81; 5 1.27,-3.81; 6 3.81,-3.81; 7 6.35,-3.81; 8 8.89,-3.81; 9 8.89,3.81; 10 6.35,3.81; 11 3.81,3.81; 12 1.27,3.81; 13 -1.27,3.81; 14 -3.81,3.81; 15 -6.35,3.81; 16 -8.89,3.81
DIL40 = drill 0.813 long: 1 -24.13,-7.62; 2 -21.59,-7.62; 3 -19.05,-7.62; 4 -16.51,-7.62; 5 -13.97,-7.62; 6 -11.43,-7.62; 7 -8.89,-7.62; 8 -6.35,-7.62; 9 -3.81,-7.62; 10 -1.27,-7.62; 11 1.27,-7.62; 12 3.81,-7.62; 13 6.35,-7.62; 14 8.89,-7.62; 15 11.43,-7.62; 16 13.97,-7.62; 17 16.51,-7.62; 18 19.05,-7.62; 19 21.59,-7.62; 20 24.13,-7.62; 21 24.13,7.62; 22 21.59,7.62; 23 19.05,7.62; 24 16.51,7.62; 25 13.97,7.62; 26 11.43,7.62; 27 8.89,7.62; 28 6.35,7.62; 29 3.81,7.62; 30 1.27,7.62; 31 -1.27,7.62; 32 -3.81,7.62; 33 -6.35,7.62; 34 -8.89,7.62; 35 -11.43,7.62; 36 -13.97,7.62; 37 -16.51,7.62; 38 -19.05,7.62; 39 -21.59,7.62; 40 -24.13,7.62
JP1 = drill 0.914 long: 1 0,-1.27; 2 0,1.27
2X03 = drill 1.016 octagon: 1 -2.54,-1.27; 2 -2.54,1.27; 3 0,-1.27; 4 0,1.27; 5 2.54,-1.27; 6 2.54,1.27
LED3MM = drill 0.813 octagon: A -1.27,0; K 1.27,0
057-010-1 = drill 1 octagon: 1 -5.08,-1.27; 2 -5.08,1.27; 3 -2.54,-1.27; 4 -2.54,1.27; 5 0,-1.27; 6 0,1.27; 7 2.54,-1.27; 8 2.54,1.27; 9 5.08,-1.27; 10 5.08,1.27
DIL08 = drill 0.813 offset: 1 -3.81,-3.81; 2 -1.27,-3.81; 3 1.27,-3.81; 4 3.81,-3.81; 5 3.81,3.81; 6 1.27,3.81; 7 -1.27,3.81; 8 -3.81,3.81
HC49U-V = drill 0.813: 1 -2.413,0; 2 2.413,0
SOT54E = drill 0.813 octagon: D -1.27,0; G 0,1.905; S 1.27,0
0207/7 = drill 0.813 octagon: 1 -3.81,0; 2 3.81,0
0207/10 = drill 0.813 octagon: 1 -5.08,0; 2 5.08,0
SJ = smd 1.168 x 1.6: 1 -0.762,0; 2 0.762,0
MA05-2 = drill 1.016 octagon: 1 -5.08,-1.27; 2 -5.08,1.27; 3 -2.54,-1.27; 4 -2.54,1.27; 5 0,-1.27; 6 0,1.27; 7 2.54,-1.27; 8 2.54,1.27; 9 5.08,-1.27; 10 5.08,1.27
BOARD = hole 3.5: 9,5; 9,95; 141,95; 141,5 | hole 1: 4,95; 146,5; 4,5; 146,95
CON_6 = drill 1 octagon: 1 -2.54,-1.27; 2 -2.54,1.27; 3 0,-1.27; 4 0,1.27; 5 2.54,-1.27; 6 2.54,1.27
CON_14 = drill 1 octagon: 1 -7.62,-1.27; 2 -7.62,1.27; 3 -5.08,-1.27; 4 -5.08,1.27; 5 -2.54,-1.27; 6 -2.54,1.27; 7 0,-1.27; 8 0,1.27; 9 2.54,-1.27; 10 2.54,1.27; 11 5.08,-1.27; 12 5.08,1.27; 13 7.62,-1.27; 14 7.62,1.27
F09HP = drill 1.016 octagon: 1 -5.486,-1.27; 2 -2.743,-1.27; 3 0,-1.27; 4 2.743,-1.27; 5 5.486,-1.27; 6 -4.115,1.27; 7 -1.372,1.27; 8 1.372,1.27; 9 4.115,1.27 | drill 3.302 pad 5.08: G1 -12.522,0; G2 12.522,0

### Placement (x,y rotation side)
C1  109.22,15.24 270 top
C2  104.14,15.24 270 top
C3  97.79,26.67 180 top
C4  109.22,55.88 90 top
C5  46.99,72.39 180 top
C6  90.93,25.65 0 top
C7  104.14,55.88 90 top
C8  66.04,68.58 90 top
C9  66.04,83.82 90 top
C10  68.58,76.2 90 top
C11  66.04,90.17 270 top
C12  81.28,55.88 90 top
C13  100.33,55.88 90 top
C14  96.52,55.88 90 top
C15  92.71,55.88 90 top
C16  88.9,55.88 90 top
C17  85.09,55.88 90 top
C18  43.18,16.51 180 top
C19  43.18,6.35 180 top
C20  68.58,40.64 180 top
DC1  25.4,10.16 0 top
IC1  53.34,11.43 270 top
IC3  55.88,81.28 90 top
IC4  101.6,40.64 0 top
JP1  38.1,81.28 90 top
JP2  15.24,78.74 180 top
LED1  71.12,17.78 270 top
LED2  76.2,17.78 270 top
LED3  81.28,17.78 270 top
LED4  78.74,86.36 90 top
LED5  86.36,86.36 90 top
LED6  93.98,86.36 90 top
LED7  101.6,86.36 90 top
LED8  109.22,86.36 90 top
LED9  116.84,86.36 90 top
LED10  124.46,86.36 90 top
LED11  132.08,86.36 90 top
LED12  45.72,2.54 0 top
LEISTUNG  6.1,19.05 90 top
OK1  30.48,58.42 90 top
OK2  30.48,45.72 90 top
OK3  30.48,33.02 90 top
Q1  106.68,22.86 0 top
Q2  78.74,78.74 90 top
Q3  109.22,78.74 90 top
Q4  132.08,78.74 90 top
Q5  116.84,78.74 90 top
Q6  101.6,78.74 90 top
Q7  86.36,78.74 90 top
Q8  93.98,78.74 90 top
R1  81.28,7.62 270 top
R2  76.2,7.62 270 top
R3  71.12,7.62 270 top
R4  78.74,93.98 90 top
R5  86.36,93.98 90 top
R6  93.98,93.98 90 top
R7  101.6,93.98 90 top
R8  109.22,93.98 90 top
R9  95.25,21.59 180 top
R10  15.24,55.88 180 top
R11  134.62,58.42 270 top
R12  116.84,93.98 90 top
R13  124.46,93.98 90 top
R14  132.08,93.98 90 top
R15  44.45,54.61 180 top
R16  44.45,62.23 180 top
R17  44.45,41.91 180 top
R18  68.58,45.72 180 top
R19  15.24,59.69 180 top
R20  15.24,44.45 180 top
R21  17.78,30.48 180 top
R22  17.78,35.56 180 top
R23  22.86,19.68 0 top
R25  44.45,49.53 180 top
R26  44.45,29.21 180 top
R27  44.45,36.83 180 top
R34  35.56,2.54 180 top
SJ1  78.74,73.66 270 bottom
SJ2  86.36,73.66 270 bottom
SJ3  93.98,73.66 270 bottom
SJ4  101.6,73.66 270 bottom
SJ5  109.22,73.66 270 bottom
SJ6  116.84,73.66 270 bottom
SJ7  124.46,73.66 270 bottom
SJ8  132.08,73.66 270 bottom
SV1  97.03,4.45 180 top
U$1  [BOARD]  0,0 0 top
U$2  142.24,50.04 90 top
U$3  139.7,22.86 90 top
X1  28.45,89.41 0 top

### Tracks (layer width: path | path; a pad name or v marks a point on that pad's centre or on a via)
5V_LST  (via drill 0.9)
  Top 0.406: v22.86,27.94 17.78,27.94 R21.2 | R22.2 17.78,40.64 v22.86,40.64 23.24,40.64 24.38,39.5 35.43,39.5 37.21,41.27 37.21,44.83 38.1,45.72 43.18,45.72 45.72,48.26 48.26,48.26 R25.1
  Top 0.61: R19.2 R10.2 R20.2 10.16,38.1 R22.2 R21.2 v3.17,30.48
  Bottom 0.406: OK3.8 v22.86,27.94 | OK2.8 24.13,41.91 v22.86,40.64
  Bottom 0.61: LEISTUNG.8 3.17,22.86 v3.17,30.48 | OK1.8 25.4,53.34 11.43,53.34 10.16,54.61 R10.2
+3V3  (via drill 0.9)
  Top 0.61: Q4.G 129.54,78.11 v129.54,71.12 139.7,60.96 v146.05,60.96
  Bottom 0.406: C7.1 109.22,59.69 128.27,59.69 129.54,60.96 v129.54,71.12
  Bottom 0.61: C7.1 100.97,51.44 99.06,51.44 97.79,50.16 IC4.32 | IC1.3 54.36,1.52 122.17,1.52 | U$3.2 U$3.1 146.05,15.24 | U$2.3 146.3,50.04 147.57,50.04 | 147.57,50.04 147.57,49.02 147.57,16.76 | v146.05,60.96 147.57,59.44 147.57,51.31 147.57,50.04
  Bottom 0.813: 146.3,50.04 146.43,50.16 | 146.43,50.16 147.57,51.31 | 146.43,50.16 147.57,49.02 147.57,50.55 147.32,50.8 | 146.05,15.24 147.57,16.76 | 122.17,1.52 124.71,1.52 U$3.2
  Bottom 1.27: C19.1 45.72,6.35 46.99,7.62 IC1.3
+24V  (via drill 0.9)
  Top 0.813: v5.33,26.92 14.48,26.92 v15.75,25.65 | v18.16,16.26 19.18,15.24 v22.86,15.24
  Bottom 0.813: LEISTUNG.10 5.33,24.64 v5.33,26.92 | v15.75,25.65 16,25.4 16,18.54 18.16,16.38 v18.16,16.26 | v22.86,15.24 24.13,13.97 24.13,8.89 22.86,7.62 20.32,7.62 19.05,8.89
  Bottom 1.016: LEISTUNG.1 15.24,5.08 17.78,5.08 19.05,6.35 19.05,8.89 DC1.2
ACCEL_X  (via drill 0.9)
  Top 0.356: 68.58,33.02 68.58,25.4 69.85,24.13 82.55,24.13
  Top 0.406: v86.36,41.53 77.09,41.53 68.58,33.02 | 82.55,24.13 95.25,11.43 130.81,11.43 133.1,9.14 144.4,9.14 v144.4,17.53
  Bottom 0.406: v144.4,17.53 141.22,17.53 U$3.3
  Bottom 0.61: C16.1 87.63,53.34 IC4.36 87.63,42.8 v86.36,41.53
ACCEL_Y  (via drill 0.9)
  Top 0.356: 66.04,33.02 66.04,24.13 67.31,22.86 81.28,22.86
  Top 0.406: 81.28,22.86 93.98,10.16 104.14,10.16 106.3,8 144.78,8 146.05,9.27 v146.05,20.32 | 66.04,33.02 76.2,43.18 v82.55,43.18
  Bottom 0.406: U$3.5 v146.05,20.32 | v82.55,43.18 82.8,43.18 84.96,45.34 84.96,48.13 IC4.37
  Bottom 0.61: C17.1 IC4.37
BAT_-
  Bottom 0.61: DC1.1 16.51,11.43 31.75,26.67 31.75,27.94
  Bottom 0.813: LEISTUNG.3 12.7,10.16 DC1.1 | 31.75,27.94 31.75,35.56 | OK3.5 30.48,36.83 31.75,35.56 | 31.75,35.56 31.75,48.26 | OK2.5 30.48,49.53 31.75,48.26 | OK1.5 30.48,62.23 31.75,60.96 31.75,48.26
BAT_PWM_CTL
  Top 0.406: R18.2 68.58,45.72 78.74,55.88 78.74,58.42 81.28,60.96 109.22,60.96 111.76,63.5 111.76,75.56 Q5.G
  Top 0.61: R18.2 63.5,44.45 63.5,21.72 60.07,18.29 24.13,18.29 20.95,19.68 R23.1
  Bottom 0.61: OK2.6 19.05,46.99 17.78,45.72 17.78,43.18 20.32,40.64 20.32,22.86 18.41,20.32 R23.1
BAT_PWM_LST
  Bottom 0.61: OK2.3 41.91,46.99 43.18,48.26 43.18,68.58 42.55,69.22 16.51,69.22 14.61,67.31 2.54,67.31 1.52,66.42 1.52,20.83 LEISTUNG.6
DIRL_CTL  (via drill 0.9)  (1 unrouted)
  Top 0.406: v38.1,57.15 45.72,57.15 46.99,58.42 46.99,68.58 44.45,71.12 44.45,86.36 54.61,95.25 88.9,95.25 v91.44,92.71 92.08,92.08 | v124.46,51.31 124.46,68.58 121.92,71.12 v121.92,92.71
  Bottom 0.406: OK1.2 v38.1,57.15 | IC4.20 124.46,34.29 v124.46,51.31 | v121.92,92.71 v91.44,92.71
DIRL_LST
  Bottom 0.406: OK1.7 21.59,57.15 R10.1
  Bottom 0.61: LEISTUNG.5 8.26,19.05 10.41,20.95 10.41,35.69 8.26,37.47 8.26,60.96 8.89,61.59 15.88,61.59 17.78,59.69 17.78,58.42 R10.1
DIRR_CTL  (via drill 0.9)
  Top 0.406: v38.1,59.69 44.45,59.69 45.72,60.96 45.72,67.31 43.18,69.85 43.18,86.36 54.61,96.52 95.25,96.52 | 95.25,96.52 99.69,92.08 Q6.G | v128.27,50.8 127,52.07 127,92.71 123.19,96.52 95.25,96.52
  Bottom 0.406: OK1.3 v38.1,59.69 | IC4.17 118.11,30.48 119.38,29.21 128.27,29.21 129.54,30.48 129.54,49.53 v128.27,50.8
DIRR_LST
  Bottom 0.406: OK1.6 R19.1
  Bottom 0.61: LEISTUNG.7 7.49,21.59 9.27,22.73 9.27,35.05 6.99,36.83 6.99,61.59 8.26,62.87 18.41,62.87 20.32,60.96 R19.1
ENABLE_CTL  (via drill 0.9)
  Top 0.406: v39.37,44.07 40.64,43.18 59.69,43.18 80.01,63.5 104.14,63.5 v107.31,66.67 Q3.G | v118.11,51.31 v118.11,62.23
  Bottom 0.406: OK2.2 v39.37,44.07 | IC4.24 v118.11,51.31 | v118.11,62.23 113.67,66.67 v107.31,66.67
ENABLE_LST  (via drill 0.9)
  Top 0.61: v15.24,64.52 15.24,45.72 15.88,44.45 R20.1
  Bottom 0.406: OK2.7 R20.1
  Bottom 0.61: LEISTUNG.9 7.37,33.66 5.08,35.56 5.08,61.59 7.87,64.52 v15.24,64.52
FOOT_SW_B  (via drill 0.9)
  Top 0.406: v129.54,53.34 130.81,54.61 R11.2
  Bottom 0.406: IC4.29 110.49,53.34 v129.54,53.34
  Bottom 0.813: U$2.5 143.51,53.98 142.88,54.61 R11.2
GND  (via drill 0.9)
  Top 0.61: C6.1 89.66,23.75 89.79,23.62 93.47,23.62 C3.2 97.66,27.81 97.66,28.57 98.04,28.96 v102.87,28.96
  Top 0.813: v138.05,49.53 138.05,44.07 v137.16,43.18
  Bottom 0.61: v102.87,28.96 IC4.11
  Bottom 0.813: U$2.4 138.56,50.04 v138.05,49.53 | v137.16,43.18 137.16,31.75 U$3.14
  pour Bottom: -2.54,104.14 -2.54,-2.54 152.4,-2.54 152.4,101.6 152.4,104.14
  pour Top: 31.75,0 149.86,0 149.86,100.33 31.75,101.6
GYRO_REF  (via drill 0.9)
  Top 0.406: v143.38,36.07 101.09,36.07 v93.98,43.18
  Bottom 0.406: U$3.11 142.11,27.94 143.38,29.21 v143.38,36.07 | v93.98,43.18 90.17,46.99 IC4.35
  Bottom 0.61: C15.1 90.17,52.07 IC4.35
GYRO_X  (via drill 0.9)  (1 unrouted)
  Top 0.406: v139.7,38.1 104.14,38.1 v99.06,43.18
  Bottom 0.406: U$3.13 140.97,36.83 v139.7,38.1 | v99.06,43.18 95.25,46.99 IC4.33
  Bottom 0.61: C13.1 97.16,51.44 95.89,51.44 95.25,50.8 95.25,48.9
GYRO_Y  (via drill 0.9)
  Top 0.406: v144.78,38.1 142.24,40.64 v104.14,40.64
  Bottom 0.406: U$3.9 142.24,25.4 144.78,27.94 v144.78,38.1 | v104.14,40.64 99.06,40.64 92.71,46.99 IC4.34
  Bottom 0.61: C14.1 95.25,53.34 93.98,53.34 92.71,52.07 IC4.34
MISO
  Bottom 0.813: IC4.7 92.71,31.75 90.93,29.59 88.39,29.59 86.36,27.94 86.36,14.61 92.08,8.89 92.08,5.21 SV1.9
MOSI  (via drill 0.9)
  Top 0.61: v102.11,8.26 v87,8.26
  Bottom 0.61: v87,8.26 84.45,10.79 84.45,27.94 87.63,30.86 90.17,30.86 IC4.6 | v102.11,8.26 SV1.1
MOTOR_PWM_L_CTL  (via drill 0.9)
  Top 0.406: v49.66,47.5 55.88,47.5 76.83,67.94 Q2.G | v121.92,51.31 121.92,68.58 119.38,71.12 v119.38,94.61
  Bottom 0.406: OK3.2 44.45,31.75 46.99,34.29 46.99,45.72 48.26,47.5 v49.66,47.5 | IC4.19 121.92,34.29 v121.92,51.31 | v119.38,94.61 77.72,94.61 76.83,93.73 Q2.G
MOTOR_PWM_L_LST  (via drill 0.9)
  Top 0.406: v5.08,10.16 7.62,10.16 12.7,15.24 12.7,22.86 13.97,24.13 26.8,24.13 28.83,26.16 28.83,30.99 23.37,30.99 R21.1
  Bottom 0.406: OK3.7 24.13,31.75 R21.1 | LEISTUNG.2 4.83,10.41 v5.08,10.16
MOTOR_PWM_R_CTL  (via drill 0.9)  (1 unrouted)
  Top 0.406: v44.58,44.7 45.34,45.72 58.42,45.72 82.55,69.85 82.55,76.83 Q7.G | v114.3,51.31 v114.3,62.23
  Bottom 0.406: OK3.3 43.18,34.29 44.45,35.56 v44.58,44.7 | IC4.18 114.3,39.37 v114.3,51.31 | v114.3,62.23 114.3,63.5 113.03,64.77 v77.47,64.77
N$1
  Bottom 0.61: C8.+ 64.77,67.31 61.59,70.48 61.59,71.75 60.96,72.39 IC3.1
N$2
  Bottom 0.406: IC4.12 105.41,24 Q1.1 C2.1
N$3
  Bottom 0.406: IC4.13 107.95,24 Q1.2 C1.1
N$4  (1 unrouted)
N$5
  Bottom 0.61: C8.- 67.31,69.85 71.12,73.66 71.12,78.74 69.85,80.01 67.31,80.01 64.77,77.47 IC3.3
N$6
  Bottom 0.61: C9.+ 66.04,81.28 64.77,80.01 IC3.4
N$7
  Bottom 0.406: R4.1 LED4.K
N$8
  Bottom 0.61: C10.+ IC3.2
N$9
  Bottom 0.61: C11.- 60.96,85.09 IC3.6
N$10
  Bottom 0.406: R5.1 LED5.K
N$11
  Bottom 0.406: R6.1 LED6.K
N$12
  Bottom 0.61: IC4.40 74.93,48.26 73.66,46.99 73.66,45.97 | C20.+ 73.66,45.72 73.66,45.97 | R18.1 73.66,45.97
N$13
  Bottom 0.406: LED6.A Q8.S
N$14
  Bottom 0.406: R7.1 LED7.K
N$15
  Bottom 0.406: R8.1 LED8.K
N$16
  Bottom 0.406: R12.1 LED9.K
N$17
  Bottom 0.406: R13.1 LED10.K
N$18
  Bottom 0.406: R14.1 LED11.K
N$19
  Bottom 0.406: LED8.A Q3.S
N$20
  Bottom 0.406: LED10.A SJ7.1
N$21
  Bottom 0.406: LED9.A Q5.S
N$22
  Bottom 0.406: Q4.D SJ8.1
N$23
  Bottom 0.406: LED7.A Q6.S
N$24
  Bottom 0.406: LED5.A Q7.S
N$25
  Bottom 0.406: Q7.D SJ2.1
N$26
  Bottom 0.406: LED4.A Q2.S
N$27
  Bottom 0.406: LED11.A Q4.S
N$28
  Bottom 0.406: R2.1 LED2.K
N$29
  Bottom 0.406: R1.1 LED3.K
N$30
  Bottom 0.406: SJ4.1 Q6.D
N$31
  Bottom 0.406: Q5.D SJ6.1
N$32
  Bottom 0.406: Q3.D SJ5.1
N$34
  Bottom 0.406: Q8.D SJ3.1
N$35  (via drill 0.9)  (4 unrouted)
  Top 1.016: v48.26,83.19 C5.1
  Bottom 0.61: 29.21,3.81 R34.2 | C4.1 107.95,53.34 106.68,53.34 102.87,49.53 IC4.30 | 29.21,19.68 R23.2
  Bottom 1.016: 109.6,54.48 112.9,54.48 114.3,55.88 132.08,55.88 | 132.08,55.88 SJ8.2 SJ4.2 SJ3.2 SJ2.2 SJ1.2 77.98,72.9 66.8,61.72 62.74,61.72 IC3.16 | 132.08,55.88 132.08,45.72 | 132.08,45.72 132.08,17.78 119.38,5.08 106.68,5.08 | U$2.1 141.73,45.72 132.08,45.72 | v48.26,83.19 46.35,81.28 JP1.1
  Bottom 1.27: C18.1 46.99,16.51 48.26,15.24 | 48.26,15.24 IC1.1 | 29.21,3.81 DC1.6 29.21,19.68 34.92,25.4 48.26,25.4 | 48.26,25.4 49.53,26.67 R26.1 R27.1 R17.1 53.34,45.72 53.34,50.8 R15.1 R16.1 49.53,69.85 C5.1 IC3.16 | 48.26,25.4 48.26,15.24 | IC4.10 C3.1 R9.1 99.06,12.7 101.6,12.7 106.68,7.62 106.68,5.08 106.68,3.17 SV1.2
N$36
  Bottom 0.406: R15.2 OK1.1
N$37
  Bottom 0.406: R16.2 OK1.4
N$38
  Bottom 0.406: R17.2 OK2.1
N$39
  Bottom 0.406: R25.2 OK2.4
N$40
  Bottom 0.406: R27.2 OK3.4
N$41
  Bottom 0.406: R26.2 OK3.1
N$42
  Bottom 0.61: R34.1 LED12.A
N$45
  Bottom 0.813: JP1.2 35.56,81.28 35.56,88.9 34.29,90.17 33.33,90.17 X1.9
N$46
  Bottom 0.406: R3.1 LED1.K
N$49  (via drill 0.9)
  Top 0.406: 15.24,12.7 15.24,20.32 16.51,21.59 29.21,21.59 30.48,22.86 30.48,33.53 23.75,33.53 22.86,34.42 R22.1
  Top 0.61: 10.41,8.26 10.59,8.42 | 10.59,8.42 15.24,12.7 | 10.59,8.42 3.21,8.42 v2.41,7.62
  Bottom 0.406: OK3.6 24.13,34.29 R22.1 | LEISTUNG.4 3.81,16.51 2.41,15.11 v2.41,7.62
NS1234
  Bottom 0.61: C9.- 64.77,85.09 62.23,82.55 IC3.5
POTI  (via drill 0.9)
  Top 0.406: v134.37,47.62 134.49,47.62 132.08,45.72 v81.28,45.72
  Bottom 0.406: U$2.2 140.21,47.62 v134.37,47.62 | v81.28,45.72 80.01,46.99 IC4.39
  Bottom 0.61: C12.1 80.01,53.34 IC4.39
RESET
  Bottom 0.813: SV1.5 97.03,9.65 91.44,15.24 R9.2 91.44,24.13 92.71,25.4 C6.2 97.79,31.75 IC4.9
RS232RX
  Bottom 0.406: IC3.14 54.1,77.47 54.1,81.28 48.26,81.28 45.72,78.74 19.05,78.74 JP2.1 19.05,80.01 20.32,81.28 20.32,83.57 19.43,84.45 10.79,84.45 9.53,83.19 9.53,78.11 10.16,77.47 JP2.6
RS232RX_CON  (via drill 0.9)
  Top 0.406: v25.4,84.45 23.5,83.06 v17.78,83.06
  Bottom 0.406: v17.78,83.06 JP2.3 | X1.2 25.4,87.83 v25.4,84.45
RS232TX  (via drill 0.9)
  Top 0.406: v12.7,82.55 11.43,83.82 8.89,83.82 7.62,82.55 7.62,76.2 8.89,74.93 v17.78,74.93
  Bottom 0.406: IC3.13 49.53,80.01 45.72,76.2 19.05,76.2 | 19.05,76.2 JP2.2 | JP2.5 v12.7,82.55 | 19.05,76.2 v17.78,74.93
RS232TX_CON
  Bottom 0.406: JP2.4 15.24,70.48 14.61,69.85 3.81,69.85 2.54,71.12 2.54,82.55 13.97,93.98 26.67,93.98 28.45,92.2 X1.3
RXD  (via drill 0.9)
  Top 0.406: v55.37,82.55 v55.37,61.09
  Bottom 0.406: IC3.12 v55.37,82.55 | v55.37,61.09 55.37,39.88 59.69,35.56 109.22,35.56 110.49,34.29 IC4.14
SCK
  Bottom 0.813: SV1.7 94.49,9.65 87.63,16.51 87.76,27.43 88.9,28.32 92.71,28.32 95.25,31.11 IC4.8
STATUS_LED1
  Bottom 0.61: IC4.2 80.01,31.75 71.12,22.86 LED1.A
STATUS_LED2
  Bottom 0.61: IC4.3 82.55,31.75 76.2,25.4 LED2.A
STATUS_LED3
  Bottom 0.61: IC4.4 85.09,31.75 81.28,27.94 LED3.A
TXD  (via drill 0.9)
  Top 0.406: v57.15,63.5 v57.15,86.36
  Bottom 0.406: IC4.15 113.03,36.83 111.76,38.1 59.69,38.1 57.15,40.64 v57.15,63.5 | v57.15,86.36 55.88,86.36
  Bottom 0.61: IC3.11 53.34,86.36 55.88,86.36

### Text on the board
Top: 5V | MOTOR_L | MOTOR_R | ENABLE | 3.3V | DIR_L | DIR_R | BAT_PWM | 1 | 2 | 3 | LSD-GR1-REG-D-T
Bottom: LSD-GR1-REG-D-B
tStop: LSD-GR1-REG-D-TSTOP
bStop: LSD-GR1-REG-D-BSTOP